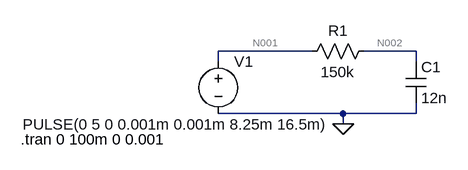
[diagram p0: schematic TP_Integrador_Simulacion.asc]
TP_Integrador_Simulacion.asc, the LTspice schematic file:
Version 4
SHEET 1 880 680
WIRE 144 112 0 112
WIRE 304 112 224 112
WIRE 0 128 0 112
WIRE 304 128 304 112
WIRE 192 208 0 208
WIRE 304 208 304 192
WIRE 304 208 192 208
WIRE 192 224 192 208
FLAG 192 224 0
SYMBOL res 240 96 R90
WINDOW 0 0 56 VBottom 2
WINDOW 3 32 56 VTop 2
SYMATTR InstName R1
SYMATTR Value 150k
SYMBOL cap 288 128 R0
SYMATTR InstName C1
SYMATTR Value 12n
SYMBOL voltage 0 112 R0
WINDOW 3 -301 113 Left 2
WINDOW 123 0 0 Left 0
WINDOW 39 0 0 Left 0
SYMATTR Value PULSE(0 5 0 0.001m 0.001m 8.25m 16.5m)
SYMATTR InstName V1
TEXT -304 248 Left 2 !.tran 0 100m 0 0.001

The netlist it stands for:
* TP_Integrador_Simulacion.asc
R1 N002 N001 150k
C1 N002 0 12n
V1 N001 0 PULSE(0 5 0 0.001m 0.001m 8.25m 16.5m)
.tran 0 100m 0 0.001
.backanno
.end

* Results of the author's LTspice run, read from the files saved beside the schematic
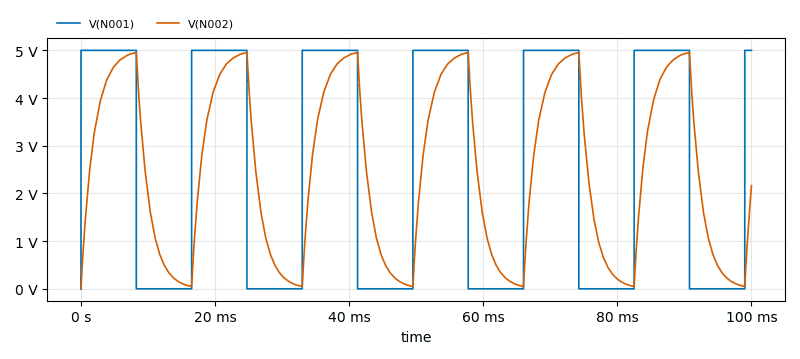
[diagram p1: Transient Analysis of TP_Integrador_Simulacion.asc, plotted from the saved traces]
* Transient Analysis, 1 run:
*   V(N001): min 0 V, max 5 V, average 2.525 V, rms 3.553 V, last 5 V
*   V(N002): min 0 V, max 4.954 V, average 2.482 V, rms 3.118 V, last 2.162 V